# Altium schematic sheet Sheet1.SchDoc
size A4
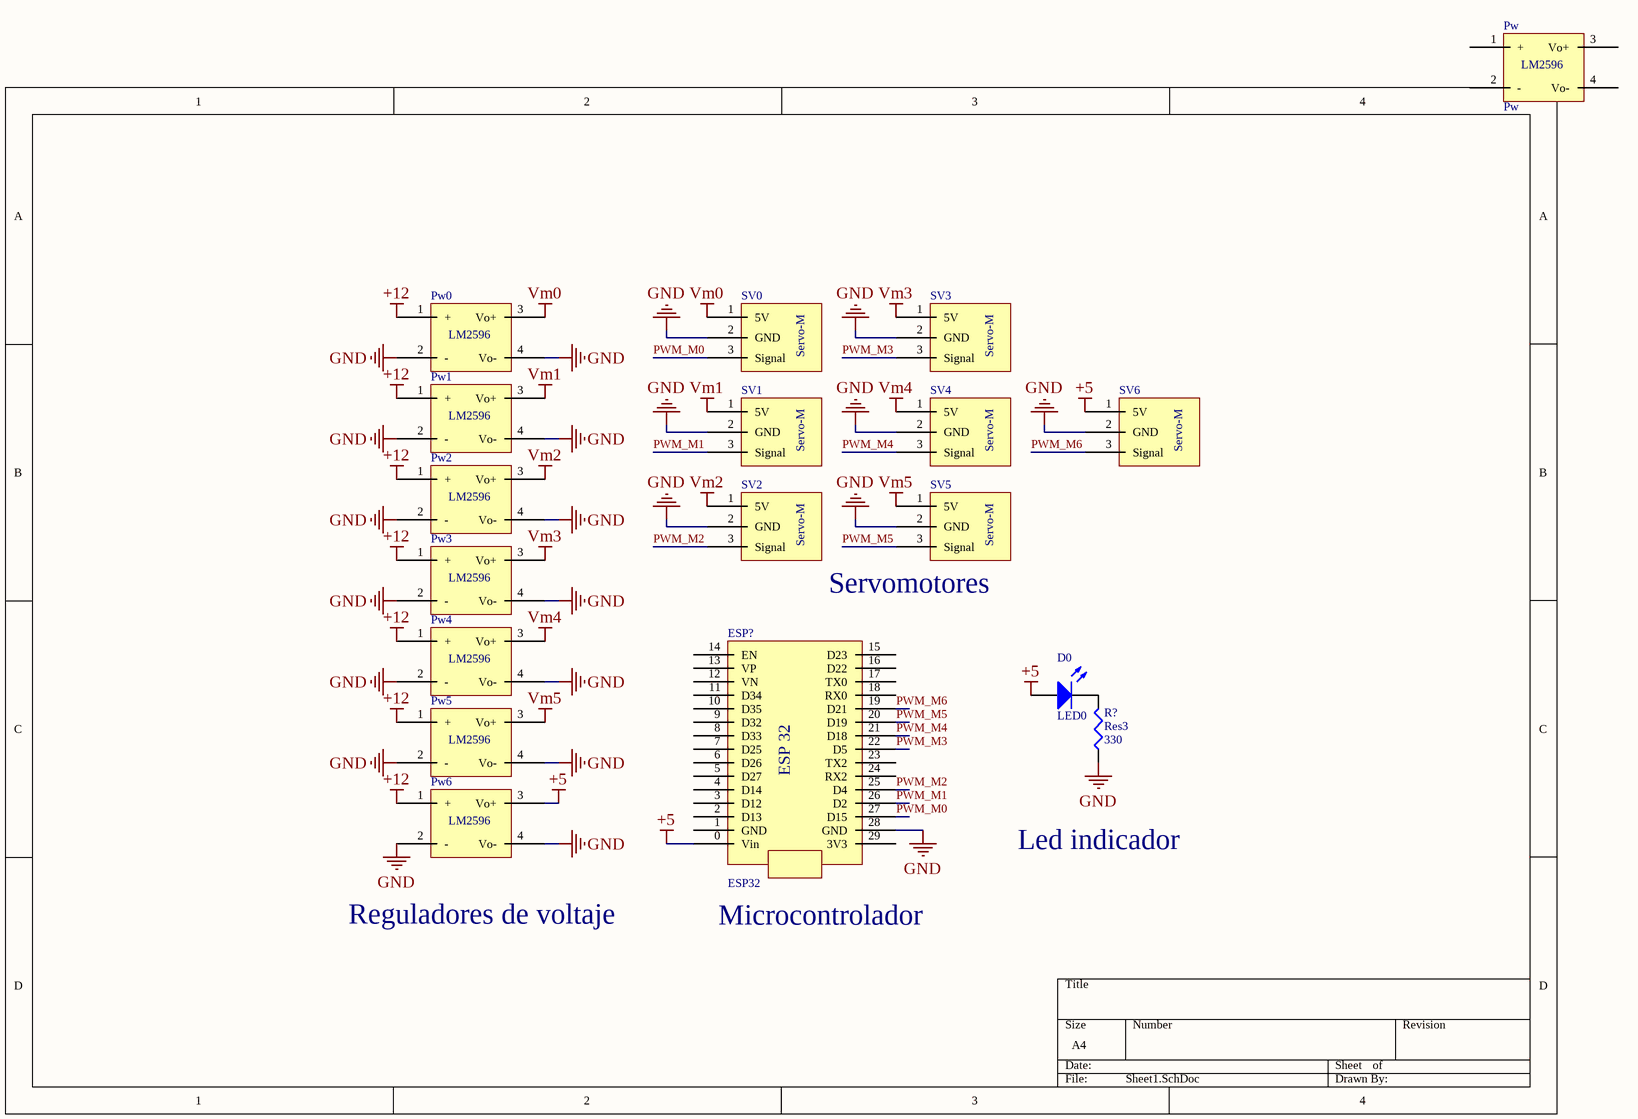
[diagram p0: Sheet1.SchDoc]

## Parts
D0  LED0  [LED-0]
ESP?  ESP32  [ESP32]
Pw  Pw
Pw0  d  (value not drawn)
Pw1  Pw  (value not drawn)
Pw2  Pw  (value not drawn)
Pw3  Pw  (value not drawn)
Pw4  Pw  (value not drawn)
Pw5  Pw  (value not drawn)
Pw6  Pw  (value not drawn)
R?  Res3  value 330  [J1-0603]
SV0  Servo-motor  (value not drawn)
SV1  SERVO-MOTOR  (value not drawn)
SV2  Servo-motor  (value not drawn)
SV3  Servo-motor  (value not drawn)
SV4  Servo-motor  (value not drawn)
SV5  Servo-motor  (value not drawn)
SV6  Servo-motor  (value not drawn)

## Nets
+5: D0.1(A) ESP?.0(Vin) Pw6.3(Vo+) SV6.1(5V)
+12: Pw0.1(+) Pw1.1(+) Pw2.1(+) Pw3.1(+) Pw4.1(+) Pw5.1(+) Pw6.1(+)
GND: ESP?.28(GND) Pw0.2(-) Pw0.4(Vo-) Pw1.2(-) Pw1.4(Vo-) Pw2.2(-) Pw2.4(Vo-) Pw3.2(-) Pw3.4(Vo-) Pw4.2(-) Pw4.4(Vo-) Pw5.2(-) Pw5.4(Vo-) Pw6.2(-) Pw6.4(Vo-) R?.1 SV0.2(GND) SV1.2(GND) SV2.2(GND) SV3.2(GND) SV4.2(GND) SV5.2(GND) SV6.2(GND)
Vm0: Pw0.3(Vo+) SV0.1(5V)
Vm1: Pw1.3(Vo+) SV1.1(5V)
Vm2: Pw2.3(Vo+) SV2.1(5V)
Vm3: Pw3.3(Vo+) SV3.1(5V)
Vm4: Pw4.3(Vo+) SV4.1(5V)
Vm5: Pw5.3(Vo+) SV5.1(5V)
PWM_M0: ESP?.27(D15) SV0.3(Signal)
PWM_M1: ESP?.26(D2) SV1.3(Signal)
PWM_M2: ESP?.25(D4) SV2.3(Signal)
PWM_M3: ESP?.22(D5) SV3.3(Signal)
PWM_M4: ESP?.21(D18) SV4.3(Signal)
PWM_M5: ESP?.20(D19) SV5.3(Signal)
PWM_M6: ESP?.19(D21) SV6.3(Signal)
NetD0_2: D0.2(K) R?.2

Not connected (* = marked no-connect by the designer): ESP? 1(GND) 2(D13) 3(D12) 4(D14) 5(D27) 6(D26) 7(D25) 8(D33) 9(D32) 10(D35) 11(D34) 12(VN) 13(VP) 14(EN) 15(D23) 16(D22) 17(TX0) 18(RX0) 23(TX2) 24(RX2) 29(3V3); Pw 1(+) 2(-) 3(Vo+) 4(Vo-)

## Notes on the sheet
- (near SV5) Servomotores
- Led indicador
- Reguladores de voltaje
- Microcontrolador
- (in symbol ESP32) ESP 32
- (in symbol Pw) LM2596
- (in symbol SERVO-MOTOR) Servo-M

## Library data of the parts
D0 = LED0: Typical INFRARED GaAs LED; Published: 8-Jun-2000; LatestRevisionDate: 08-Jul-2005; LatestRevisionNote: Mech Layer 1 removed.; PackageReference: LED-0; Publisher: Altium Limited; PackageDescription: LED; 2 Leads
Pw0 = Pw
R? = Res3: Resistor; Published: 8-Jun-2000; LatestRevisionDate: 29-May-2009; LatestRevisionNote: IPC-7351 Footprint Added.; PackageReference: J1-0603; Publisher: Altium Limited; PackageDescription: Chip Resistor